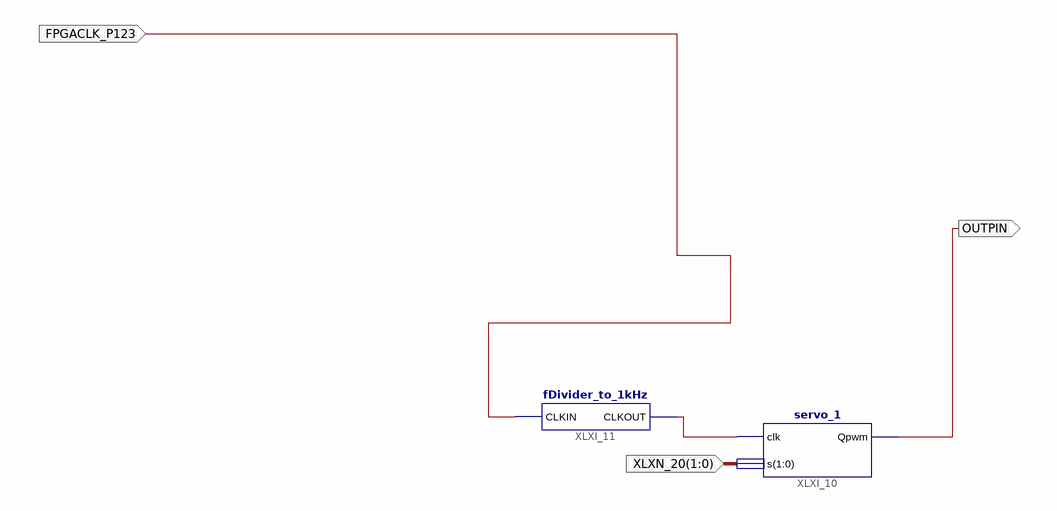
[diagram p0: schematic sheet 1]
// Xilinx ISE schematic MainCircuit.sch (spartan6) as structural Verilog: 2 symbols, 3 ports
module MainCircuit (
  input  FPGACLK_P123,
  input  [1:0] XLXN_20,
  output OUTPIN
);

  wire XLXN_17;

  servo_1 XLXI_10 (.clk(XLXN_17), .s(XLXN_20), .Qpwm(OUTPIN));
  fDivider_to_1kHz XLXI_11 (.CLKIN(FPGACLK_P123), .CLKOUT(XLXN_17));
endmodule
